# EasyEDA Pro project Led_lane(EasyEDA_PRO).eprj

# Schematic Schematic1
Board Name: Board1; Create Date: 2026-03-28; Page Name: P1; Project Name: Led_lane; Schematic Name: Schematic1; Update Date: 2026-03-30; Company: EasyEDA.com; Page Size: A4; Version: V1.0
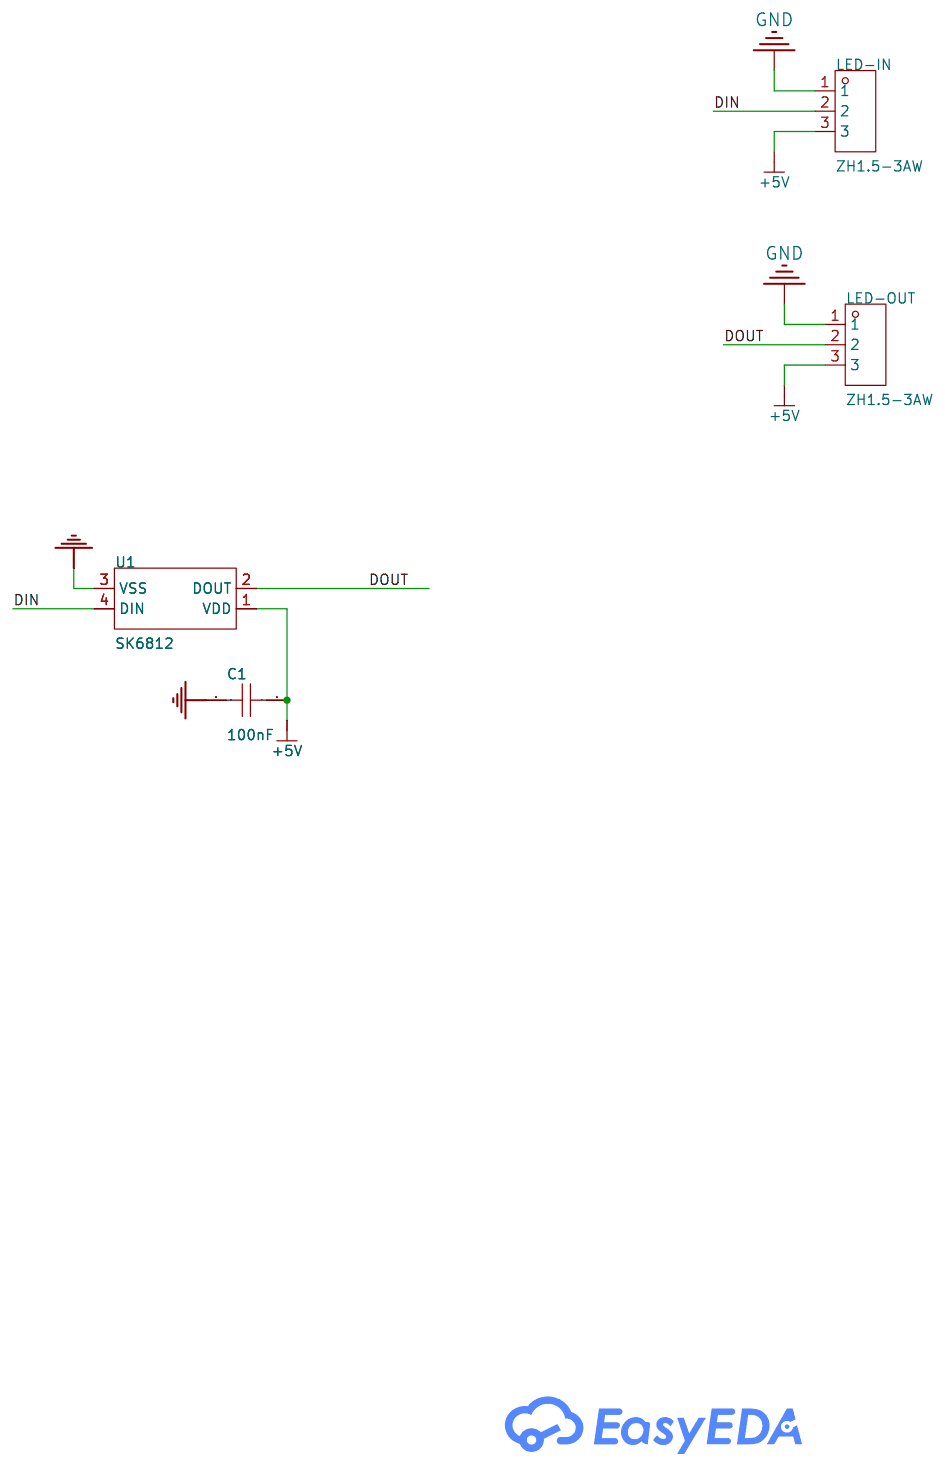
[diagram p0: schematic sheet]

## Parts
C1  100nF  [C0603]
LED-IN  ZH1.5-3AW  [CONN-TH_ZH1.5-3AW]
LED-OUT  ZH1.5-3AW  [CONN-TH_ZH1.5-3AW]
U1  SK6812  [LED-SMD_4P-L5.0-W5.0-LS5.4-TL-1]

## Library data of the parts
C1 = CAP_0603: Supplier Footprint: 0603
LED-IN LED-OUT = ZH1.5-3AW_C722915: LCSC Part Name: 1x3P 间距:1.5mm 弯插 系列:ZH; Supplier Part: C722915; Manufacturer: CAX(创都); Supplier Footprint: 弯插,P=1.5mm; JLCPCB Part Class: Extended Part; Datasheet: https://item.szlcsc.com/datasheet/ZH1.5-3AW/767122.html; Supplier: LCSC; Pins Structure: 1x3P; Pitch: 1.5mm; Mounting Type: Right Angle; Reference Series: ZH; Number of Pins: 3P; Number of Rows: 1; Number of PINs Per Row: 3; Current Rating: 1A; Contact Material: Brass; Contact Plating: Tin; Operating Temperature: -25℃~+85℃; Voltage Rating: 100V; Plastic Material: PBT; Flame Retardant Rating: UL94V-0; Z-Height of the Board: 3.6mm; Y-Width of Bottom Edge on Board: 4.5mm
U1 = SK6812_C5378720: Wavelength:R:620nm~625nm；B:460nm~470nm；G:520nm~530nm Luminous Intensity:B:160mcd~320mcd；R:280mcd~515mcd；G:815mcd~1275mcd Fixed-Frequency Pwm Mode:1kHz Data Transmission Rate:800Kbit/s Voltage - Supply:3.7V~5.5V Voltage - Supply:3.7V~5.5V Quiescent Current; LCSC Part Name: 5.4x5.0x1.6毫米0.2W智能外控表面贴装SMD型LED; Supplier Part: C5378720; Manufacturer: 欧思科光电; Supplier Footprint: SMD-4P,5.4x5mm; JLCPCB Part Class: Extended Part; Datasheet: https://item.szlcsc.com/datasheet/SK6812/6242291.html; Supplier: LCSC; Wavelength: R:620nm~625nm；B:460nm~470nm；G:520nm~530nm; Luminous Intensity: B:160mcd~320mcd；R:280mcd~515mcd；G:815mcd~1275mcd; Fixed-Frequency Pwm Mode: 1kHz; Data Transmission Rate: 800Kbit/s; Voltage - Supply: 3.7V~5.5V; Quiescent Current: 0.6mA; Lens Color: Semi-transparent lens; ESD Withstand Voltage: 2000V; Operating Temperature: -40℃~+85℃; Viewing Angle: 120°; Height: 1.6mm

## Nets
+5V: C1.1 LED-IN.3 LED-OUT.3 U1.1(VDD)
GND: C1.2 LED-IN.1 LED-OUT.1 U1.3(VSS)
DIN: LED-IN.2 U1.4(DIN)
DOUT: LED-OUT.2 U1.2(DOUT)

# Board PCB1
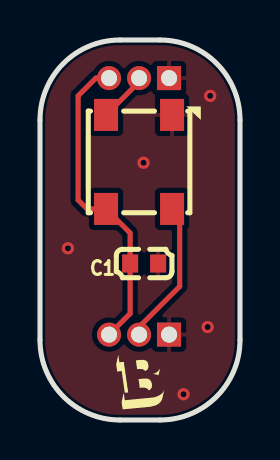
[diagram p1: board, top side]
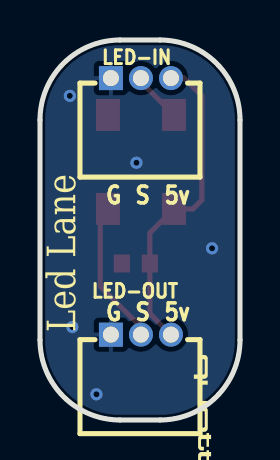
[diagram p2: board, bottom side, seen from below]

Outline 10 x 19 mm; copper layers: Top Layer, Bottom Layer. Coordinates in mm from the lower left corner of the outline.
Outline path: 0,15 0,4 arc(1.17,1.17) 4,0 6,0 arc(8.83,1.17) 10,4 10,15 arc(8.83,17.83) 6,19 4,19 arc(1.17,17.83) 0,15
Stack: Top Layer 0.035mm / Dielectric1 1.51mm FR4 er 4.5 / Bottom Layer 0.035mm

## Design rules (mm)
template: JLCPCB Capability(Two Layers Board)
spacing copperThickness1oz (default): track to track 0.102, other pairs 0.152 to 0.3
spacing copperThickness2oz: track to track 0.203, other pairs 0.152 to 0.3
track width copperThickness1oz (default): min 0.127, default 0.254, max 2.54
track width copperThickness2oz: min 0.203, default 0.254, max 2.54
differential pair differentialPair (default): width min 0.127, default 0.254, max 2.54; gap min 0.152, default 0.152
via viaSize (default): diameter min 0.5, default 0.61, max 10; hole min 0.3, default 0.305, max 6.3

## Placement (name value [footprint] x y rotation side)
C1  100nF  [C0603]  5.21 7.82 0 top
LED-IN  ZH1.5-3AW  [CONN-TH_ZH1.5-3AW]  4.95 17.09 180 bottom
LED-OUT  ZH1.5-3AW  [CONN-TH_ZH1.5-3AW]  4.95 4.27 180 bottom
U1  SK6812  [LED-SMD_4P-L5.0-W5.0-LS5.4-TL-1]  4.95 12.9 90 top

## Footprints (pads in the part's own frame, mm; a bottom-side part is the same pattern mirrored in y, then rotated)
C0603
  rect 0.8x0.9 smd: 1(-0.7,0) 2(0.7,0)
CONN-TH_ZH1.5-3AW
  rect 1.2x1.2 hole 0.8: 1(-1.5,0)
  round 1.2 hole 0.8: 2(-0.001,0) 3(1.5,0)
LED-SMD_4P-L5.0-W5.0-LS5.4-TL-1
  rect 1.6x1.2 smd: 1(-2.35,1.65) 2(-2.35,-1.65) 3(2.35,-1.65) 4(2.35,1.65)

## Nets
As in the schematic.

## Via types
v1: diameter 0.61, hole 0.305, Top Layer to Bottom Layer, 5 vias

## Routing (per net, layer and track width the routed paths; a pad name or vN(x,y) marks a point on that pad's centre or on a via; arc(x,y) is an arc through that point)
+5V: length 15.9
  Top Layer w0.254: LED-IN.3 2.79,17.09 1.91,16.21 1.91,11 2.35,10.55 U1.1 4.51,9.35 C1.1 4.51,5.32 LED-OUT.3
GND:
  vias: v1(1.4,8.59) v1(5.18,12.86) v1(7.18,1.29) v1(8.38,4.65) v1(8.51,16.21)
DIN: length 2.5
  Top Layer w0.254: U1.4 4.95,16.91 LED-IN.2
DOUT: length 7.3
  Top Layer w0.254: U1.2 6.99,10.17 6.99,6.68 4.95,4.65 LED-OUT.2

## Copper pours and planes (outline as drawn; the poured copper is in the pictures)
GND on Top Layer: -1.02,19.76 10.92,19.76 10.92,-1.07 -1.02,-1.07
GND on Bottom Layer: -0.25,19.76 10.73,19.76 10.73,-0.56 -0.25,-0.56

## Text on the board
Bottom Silkscreen Layer: 5v | S | G | Led Lane
